# EAGLE design cont_board (EAGLE 7.2.0)
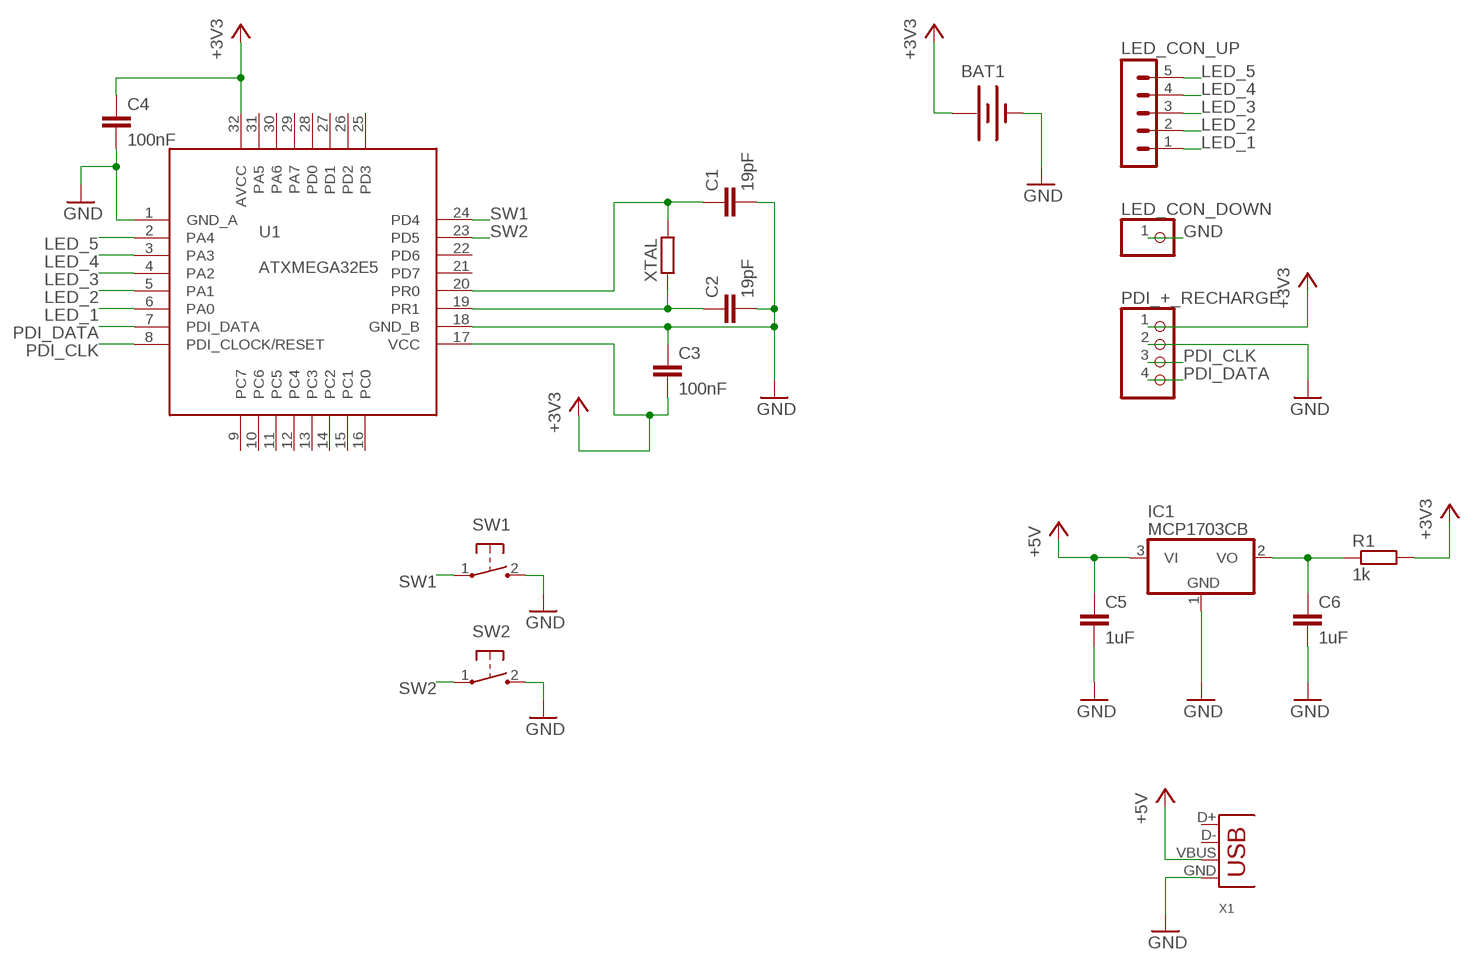
[diagram p0: schematic, sheet 1]

## Parts
BAT1  BATTERY12MM  [BATTCON_12MM]
C1  19pF  C-EUC0402  [C0402]
C2  19pF  C-EUC0402  [C0402]
C3  100nF  C-EUC0402  [C0402]
C4  100nF  C-EUC0402  [C0402]
C5  1uF  C-EUC0402  [C0402]
C6  1uF  C-EUC0402  [C0402]
IC1  MCP1703CB  [SOT23]
LED_CON_DOWN  PINHD-1X1  [1X01]
LED_CON_UP  MA05-1  [MA05-1]
PDI_+_RECHARGE  PINHD-1X4  [1X04]
R1  1k  R-EU_R0402  [R0402]
SW1  TAC_SWITCHSMD  [TACTILE-SWITCH-SMD]
SW2  TAC_SWITCHSMD  [TACTILE-SWITCH-SMD]
U1  ATXMEGA32E5  [TQFP32-08]
X1  USBMICRO-B  [USB-MB-H]
XTAL  R-EU_R0805  [R0805]

## Nets
+3V3: BAT1.PWR@1(+) C3.2 C4.1 PDI_+_RECHARGE.1 R1.2 U1.17(VCC) U1.32(AVCC)
+5V: C5.1 IC1.3(VI) X1.VBUS
GND: BAT1.GND(-) C1.2 C2.2 C3.1 C4.2 C5.2 C6.2 IC1.1(GND) LED_CON_DOWN.1 PDI_+_RECHARGE.2 SW1.2 SW2.2 U1.1(GND_A) U1.18(GND_B) X1.GND
LED_1: LED_CON_UP.1 U1.6(PA0)
LED_2: LED_CON_UP.2 U1.5(PA1)
LED_3: LED_CON_UP.3 U1.4(PA2)
LED_4: LED_CON_UP.4 U1.3(PA3)
LED_5: LED_CON_UP.5 U1.2(PA4)
N$1: C1.1 U1.20(PR0) XTAL.2
N$2: C2.1 U1.19(PR1) XTAL.1
N$3: C6.1 IC1.2(VO) R1.1
PDI_CLK: PDI_+_RECHARGE.3 U1.8(PDI_CLOCK/RESET)
PDI_DATA: PDI_+_RECHARGE.4 U1.7(PDI_DATA)
SW1: SW1.1 U1.24(PD4)
SW2: SW2.1 U1.23(PD5)
Unconnected: U1.9(PC7) U1.10(PC6) U1.11(PC5) U1.12(PC4) U1.13(PC3) U1.14(PC2) U1.15(PC1) U1.16(PC0) U1.21(PD7) U1.22(PD6) U1.25(PD3) U1.26(PD2) U1.27(PD1) U1.28(PD0) U1.29(PA7) U1.30(PA6) U1.31(PA5) X1.D+ X1.D-

## Library data of the parts
BAT1 = SparkFun-Electromechanical:BATTERY: Battery Holders Various common sizes : AA, AAA, 18650 (PRT-12895), 20mm coin cell and 12mm coin cell. 20MM_4LEGS, BATT-10373; PROD_ID: BATT-08044
C1-C6 = rcl:C-EU: CAPACITOR, European symbol
IC1 = linear:MCP1703: 250 mA, 16V, Low Quiescent Current LDO Regulator Source: http://ww1.microchip.com/downloads/en/DeviceDoc/22049b.pdf
LED_CON_DOWN = pinhead:PINHD-1X1: PIN HEADER
LED_CON_UP = con-lstb:MA05-1: PIN HEADER; OC_FARNELL: unknown; OC_NEWARK: unknown
PDI_+_RECHARGE = pinhead:PINHD-1X4: PIN HEADER
R1 XTAL = rcl:R-EU_: RESISTOR, European symbol
SW1 SW2 = smd_switch:TAC_SWITCH: Momentary Switch TE Connectivity Č. části Mouser: 506-147873-1 Číslo části výrobce: 147873-1 http://cz.mouser.com/ProductDetail/TE-Connectivity-Alcoswitch/147873-1/?qs=sGAEpiMZZMtFyPk3yBMYYGJXFVLpqpECzfz8kxTwuGk%3d; PROD_ID: SWCH-08247; VALUE: TAC_SWITCHSMD
U1 = Atmel_By_element14_Batch_1-00:ATXMEGA32E5; DESCRIPTION: MCU; MPN: ATXMEGA32E5-AU; OC_FARNELL: 2327713; PACKAGE: TQFP32-08; SUPPLIER: Atmel
X1 = micro_usb:USB: USB Connectors

## Board
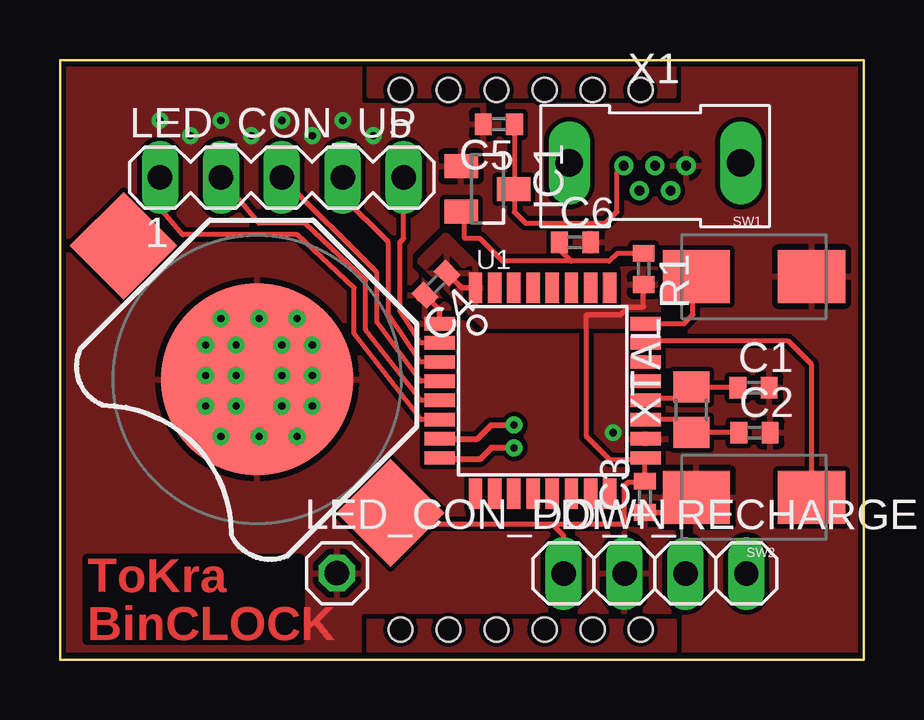
[diagram p1: board, top side]
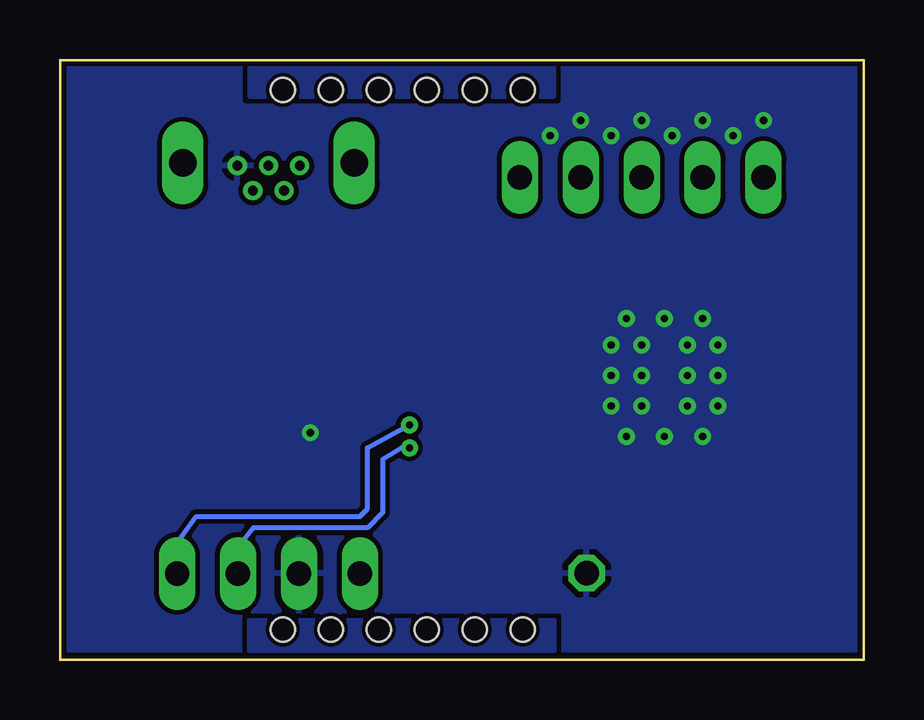
[diagram p2: board, bottom side, seen from below]

Size 33.5 x 25 mm. Coordinates in mm from the lower left corner, seen from the top.
Outline: 0,25 33.5,25 33.5,0 0,0 0,25
Copper layers (1*16): Top 0.018mm / dielectric 1.5mm / Bottom 0.018mm
Design rules "apama_pool_2_layers": minimum track width 0.2mm, minimum drill 0.3mm, track to track 0.2mm, track to pad 0.2mm, pad to pad 0.2mm, via to via 0.2mm, smd to smd 0.2mm, copper to edge 0.2mm, drill to drill 0.3mm, minimum pad ring 0.2mm, minimum via ring 0.2mm, stop-mask expansion 0.15mm, vias tented up to drill 0.3mm, thermal gap 10mil
Holes 1 mm at 14.2,1.25 16.2,1.25 18.2,1.25 20.2,1.25 22.2,1.25 24.2,1.25 14.2,23.75 16.2,23.75 18.2,23.75 20.2,23.75 22.2,23.75 24.2,23.75
tRestrict: 4 lines

### Footprints (pad centres in the part's own frame; a part is rotated, then mirrored left to right if it is on the bottom)
BATTCON_12MM = smd 8 x 8: GND 0,0 | smd 3.175 x 3.175: PWR@1 -7.874,0; PWR@2 7.874,0
C0402 = smd 0.7 x 0.9: 1 -0.65,0; 2 0.65,0
SOT23 = smd 1 x 1.4: 1 -0.95,-1.1; 2 0.95,-1.1; 3 0,1.1
1X01 = drill 1.016 octagon: 1 0,0
MA05-1 = drill 1.016 long: 1 -5.08,0; 2 -2.54,0; 3 0,0; 4 2.54,0; 5 5.08,0
1X04 = drill 1.016 long: 1 -3.81,0; 2 -1.27,0; 3 1.27,0; 4 3.81,0
R0402 = smd 0.7 x 0.9: 1 -0.65,0; 2 0.65,0
TACTILE-SWITCH-SMD = smd 2.8 x 2.2: 1 -2.4,0; 2 2.4,0
TQFP32-08 = smd 1.27 x 0.559: 1 -4.293,2.8; 2 -4.293,2; 3 -4.293,1.2; 4 -4.293,0.4; 5 -4.293,-0.4; 6 -4.293,-1.2; 7 -4.293,-2; 8 -4.293,-2.8; 17 4.293,-2.8; 18 4.293,-2; 19 4.293,-1.2; 20 4.293,-0.4; 21 4.293,0.4; 22 4.293,1.2; 23 4.293,2; 24 4.293,2.8 | smd 0.559 x 1.27: 9 -2.8,-4.293; 10 -2,-4.293; 11 -1.2,-4.293; 12 -0.4,-4.293; 13 0.4,-4.293; 14 1.2,-4.293; 15 2,-4.293; 16 2.8,-4.293; 25 2.8,4.293; 26 2,4.293; 27 1.2,4.293; 28 0.4,4.293; 29 -0.4,4.293; 30 -1.2,4.293; 31 -2,4.293; 32 -2.8,4.293
USB-MB-H = drill 0.4: D+ 0,0.02; D- -0.65,-1.02; GND 1.3,0.02; ID 0.65,-1.02; VBUS -1.3,0.02 | drill 1.15 long: P$6 3.575,0.13; P$7 -3.575,0.13
R0805 = smd 1.3 x 1.5: 1 -0.95,0; 2 0.95,0

### Placement (x,y rotation side)
BAT1  8.22,11.68 135 top
C1  28.91,11.34 0 top
C2  28.95,9.46 0 top
C3  24.39,6.79 90 top
C4  15.68,15.65 225 top
C5  18.3,22.32 180 top
C6  21.47,17.4 0 top
IC1  17.82,19.62 270 top
LED_CON_DOWN  11.55,3.6 0 top
LED_CON_UP  9.25,20.1 0 top
PDI_+_RECHARGE  24.81,3.59 0 top
R1  24.33,16.29 270 top
SW1  28.93,15.97 0 top
SW2  28.93,6.76 180 top
U1  20.12,11.21 0 top
X1  24.81,20.57 0 top
XTAL  26.31,10.41 90 top

### Tracks (layer width: path | path; a pad name or v marks a point on that pad's centre or on a via)
3
  pour Top (isolate 0.1): 12.9,24.75 25.6,24.75 25.6,23.5 12.9,23.5
  pour Bottom (isolate 0.1): 12.9,24.75 25.6,24.75 25.6,23.5 12.9,23.5
+3V3
  Top 0.2: 13.79,5.4 BAT1.PWR@1 14.25,5.65 20.52,5.65 | 24.13,8.41 U1.17 24.39,8.38 C3.2 24.34,7.4 23.7,7.4 23.54,7.24 23.54,5.81 23.38,5.65 20.52,5.65 | C4.1 16.75,15.5 U1.32 | R1.2 24.33,14.7 23.7,14.7 23.38,14.38 21.95,14.38 21.95,9.3 22.93,8.32 24.33,8.32 | PDI_+_RECHARGE.1 21,5.17 20.52,5.65
  Top 0.254: 24.33,8.32 U1.17
  pour Top (isolate 0.2): 14.96,16.61 17.66,13.91 24.96,13.91 24.96,16.29 17.5,16.29 16.07,17.72
+5V
  Top 0.2: C5.1 18.95,19.65 | 18.95,19.65 IC1.3 | 18.95,19.65 18.95,18.65 19.41,18.19 22.74,18.19 23.22,18.67 23.22,20.31 X1.VBUS
GND  (via drill 0.3)
  Top 0.2: U1.1 15.83,14.58 C4.2 15.04,15.02 14.96,15.02 | C3.1 25.91,6.14 SW2.2
  Top 0.254: 24.48,9.14 U1.18
  other vias: 9.25,13.11 9.88,14.22 10.52,13.11 10.52,10.57 9.25,10.57 9.88,9.3 8.3,9.3 6.71,9.3 7.34,10.57 6.07,10.57 7.34,13.11 6.07,13.11 6.71,14.22 8.3,14.22 13.06,21.84 10.52,21.84 7.98,21.84 5.44,21.84 6.71,22.48 9.25,22.48 11.79,22.48 4.17,22.48 10.52,11.84 6.07,11.84 7.34,11.84 9.25,11.84 23.06,9.46
  pour Top (isolate 0.127, rank 2): 0.25,24.75 33.25,24.75 33.25,0.4 0.25,0.4
  pour Bottom (rank 2): 0.25,24.75 33.25,24.75 33.25,0.4 0.25,0.4
LED_1
  Top 0.2: U1.6 15.05,10.01 12.26,13.59 12.26,15.49 9.88,17.72 5.12,17.72 4.17,18.83 LED_CON_UP.1
LED_2
  Top 0.2: U1.5 15.05,10.81 12.74,13.75 12.74,15.81 10.2,18.19 8.3,18.19 LED_CON_UP.2
LED_3
  Top 0.2: U1.4 15.04,11.61 13.22,14.06 13.22,16.13 LED_CON_UP.3
LED_4
  Top 0.2: U1.3 15.03,12.41 13.69,14.38 13.69,17.4 11.79,19.3 LED_CON_UP.4
LED_5
  Top 0.2: U1.2 15.03,13.21 14.17,14.54 14.17,17.4 14.33,17.56 LED_CON_UP.5
N$1
  Top 0.2: C1.1 26.34,11.34 XTAL.2 25.84,10.89 24.5,10.89 arc90 U1.20
  Top 0.254: 24.49,10.73 U1.20
N$2
  Top 0.2: 24.49,9.94 U1.19 26.09,10.01 26.31,9.78 XTAL.1 C2.1
N$3
  Top 0.2: 24.66,16.94 R1.1 23.23,16.94 22.9,16.61 21.31,16.61 | 21.31,16.61 18.46,16.61 17.5,17.56 16.87,17.56 16.87,18.52 IC1.2 | C6.1 20.82,17.1 21.31,16.61
N$4
  pour Bottom (isolate 0.1): 12.9,1.6 25.6,1.6 25.6,0.4 12.9,0.4
NARAM
  pour Top: 12.9,1.6 25.6,1.6 25.6,0.4 12.9,0.4
PDI_CLK  (via drill 0.3)
  Top 0.254: v18.93,8.83 17.98,8.83 17.5,8.35 15.89,8.35 U1.8
  Bottom 0.2: v18.93,8.83 19.25,8.83 20.04,8.35 20.04,6.13 20.68,5.49 25.44,5.49 26.08,4.7 PDI_+_RECHARGE.3
PDI_DATA  (via drill 0.3)
  Top 0.254: U1.7 17.41,9.21 17.98,9.78 v18.93,9.78
  Bottom 0.2: PDI_+_RECHARGE.4 28.62,4.86 27.82,5.97 21,5.97 20.68,6.29 20.68,8.83 v18.93,9.78
SW1
  Top 0.2: U1.24 26.02,14.01 26.39,14.38 26.39,15.83 SW1.1
SW2
  Top 0.2: SW2.1 31.33,12.3 30.36,13.27 24.48,13.27 U1.23

### Text on the board
Top: ToKra / BinCLOCK